# EAGLE design controller (EAGLE 5.07)
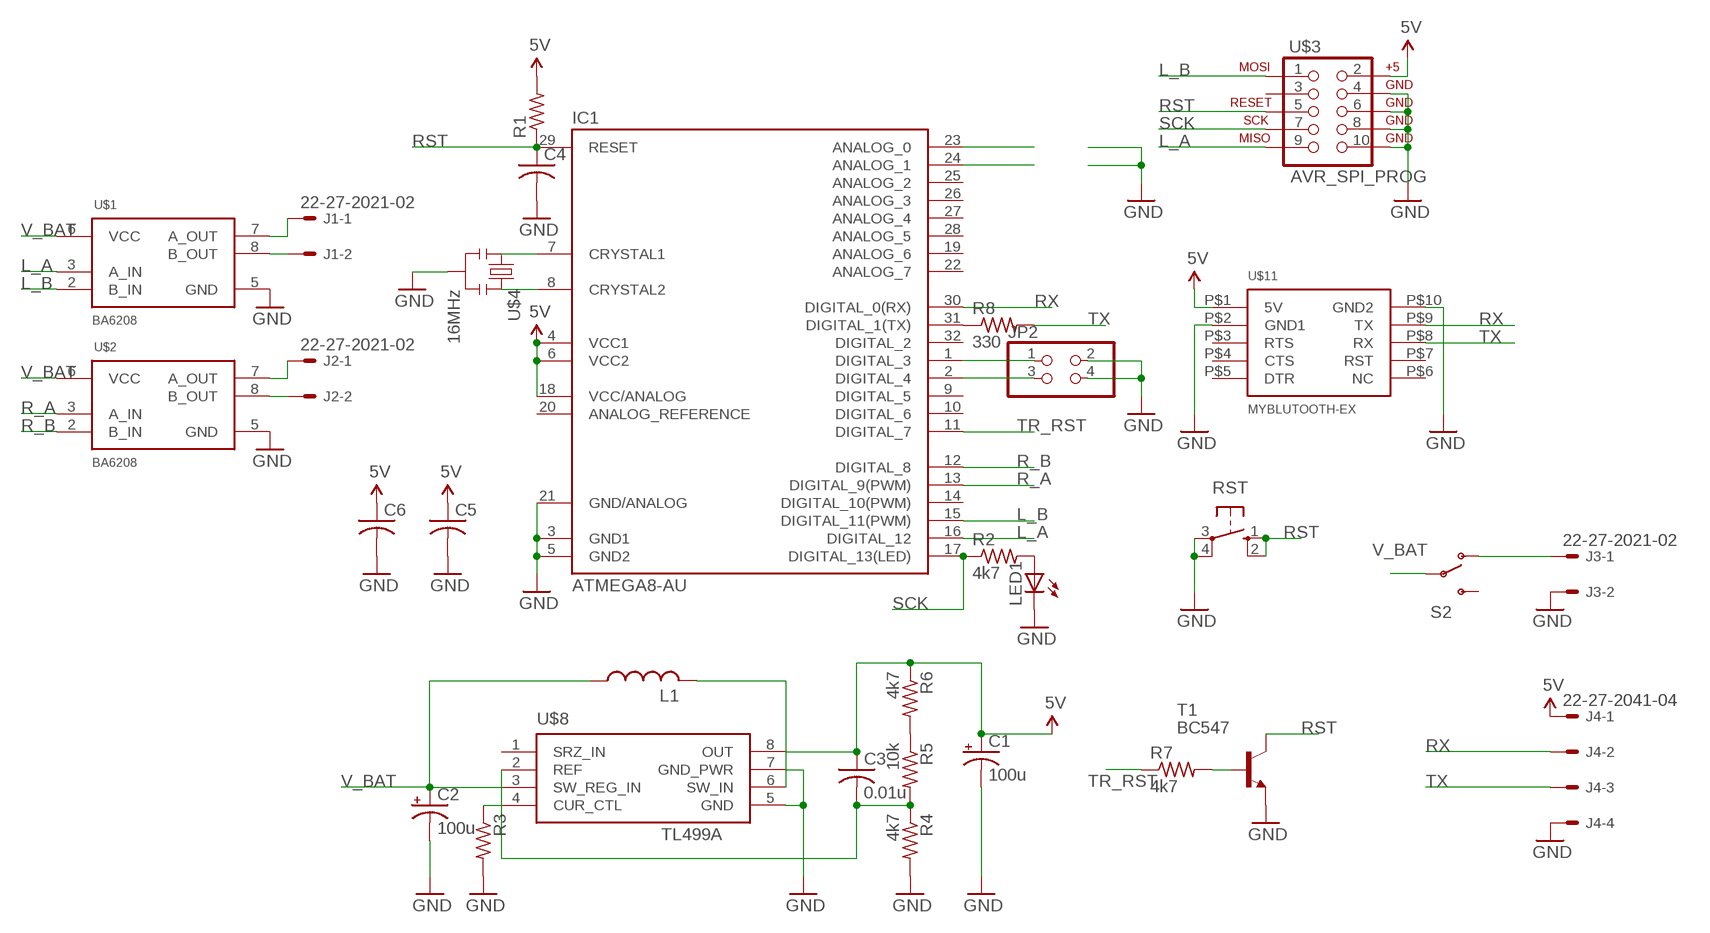
[diagram p0: schematic, sheet 1]

## Parts
C1  100u  CPOL-USE2,5-6E  [E2,5-6E]
C2  100u  CPOL-USE2,5-6E  [E2,5-6E]
C3  0.01u  C-US050-025X075  [C050-025X075]
C4  C-US050-025X075  [C050-025X075]
C5  C-US050-025X075  [C050-025X075]
C6  C-US050-025X075  [C050-025X075]
IC1  ATMEGA8-AU  [TQFP32-08]
J1  22-27-2021-02  [6410-02]
J2  22-27-2021-02  [6410-02]
J3  22-27-2021-02  [6410-02]
J4  22-27-2041-04  [6410-04]
JP2  PINHD-2X2  [2X02]
L1  L-USTJ3-U1  [TJ3-U1]
LED1  LED5MM  [LED5MM]
R1  R-US_0207/10  [0207/10]
R2  4k7  R-US_0207/7  [0207/7]
R3  R-US_0207/7  [0207/7]
R4  4k7  R-US_0207/7  [0207/7]
R5  10k  R-US_0207/7  [0207/7]
R6  4k7  R-US_0207/7  [0207/7]
R7  4k7  R-US_0207/7  [0207/7]
R8  330  R-US_0207/7  [0207/7]
RST  10-XX  [B3F-10XX]
S2  SWITCH-SPSTPTH  [SWITCH-SPDT]
T1  BC547  [TO92]
U$1  BA6208  [SIP-9]
U$2  BA6208  [SIP-9]
U$3  AVR_SPI_PROG  [AVR_ICSP]
U$4  16MHz  RESONATORPTH  [RESONATOR-PTH]
U$8  TL499A  [DIL08]
U$11  MYBLUTOOTH-EX  [WITHROBOT_SERIAL]

## Nets
5V: C1.+ C3.1 C5.1 C6.1 IC1.4(VCC1) IC1.6(VCC2) IC1.18(VCC/ANALOG) J4.1 R1.2 R6.1 U$3.2 U$8.8(OUT) U$11.P$1(5V)
GND: C1.- C2.- C4.2 C5.2 C6.2 IC1.3(GND1) IC1.5(GND2) IC1.21(GND/ANALOG) J3.2 J4.4 JP2.2 JP2.4 LED1.K(C) R3.2 R4.2 RST.3(P) RST.4(P1) T1.1(E) U$1.5(GND) U$2.5(GND) U$3.4 U$3.6 U$3.8 U$3.10 U$4.2 U$8.5(GND) U$8.7(GND_PWR) U$11.P$2(GND1) U$11.P$10(GND2)
L_A: IC1.16(DIGITAL_12) U$1.3(A_IN) U$3.9
L_B: IC1.15(DIGITAL_11(PWM)) U$1.2(B_IN) U$3.1
N$1: IC1.8(CRYSTAL2) U$4.3
N$2: IC1.7(CRYSTAL1) U$4.1
N$3: J2.2 U$2.8(B_OUT)
N$4: J2.1 U$2.7(A_OUT)
N$5: J1.2 U$1.8(B_OUT)
N$6: J1.1 U$1.7(A_OUT)
N$7: LED1.A R2.2
N$8: J3.1 S2.1(O)
N$9: R3.1 U$8.4(CUR_CTL)
N$10: C3.2 R4.1 R5.2 U$8.2(REF)
N$11: IC1.23(ANALOG_0)
N$12: R5.1 R6.2
N$13: L1.2 U$8.6(SW_IN)
N$14: R7.2 T1.2(B)
N$15: IC1.24(ANALOG_1)
N$16: IC1.1(DIGITAL_3) JP2.1
N$17: IC1.2(DIGITAL_4) JP2.3
N$18: IC1.31(DIGITAL_1(TX)) R8.1
R_A: IC1.13(DIGITAL_9(PWM)) U$2.3(A_IN)
R_B: IC1.12(DIGITAL_8) U$2.2(B_IN)
RST: C4.1 IC1.29(RESET) R1.1 RST.1(S) RST.2(S1) T1.3(C) U$3.5
RX: IC1.30(DIGITAL_0(RX)) J4.2 U$11.P$9(TX)
SCK: IC1.17(DIGITAL_13(LED)) R2.1 U$3.7
TR_RST: IC1.11(DIGITAL_7) R7.1
TX: J4.3 R8.2 U$11.P$8(RX)
V_BAT: C2.+ L1.1 S2.2(P) U$1.6(VCC) U$2.6(VCC) U$8.3(SW_REG_IN)
Unconnected: IC1.9(DIGITAL_5) IC1.10(DIGITAL_6) IC1.14(DIGITAL_10(PWM)) IC1.19(ANALOG_6) IC1.20(ANALOG_REFERENCE) IC1.22(ANALOG_7) IC1.25(ANALOG_2) IC1.26(ANALOG_3) IC1.27(ANALOG_4) IC1.28(ANALOG_5) IC1.32(DIGITAL_2) S2.3(S) U$3.3 U$8.1(SRZ_IN) U$11.P$3(RTS) U$11.P$4(CTS) U$11.P$5(DTR) U$11.P$6(NC) U$11.P$7(RST)

## Library data of the parts
C1 C2 = rcl:CPOL-US: POLARIZED CAPACITOR, American symbol
C3-C6 = rcl:C-US: CAPACITOR, American symbol
IC1 = Arduino-AVR:ATMEGA8
J1-J3 = con-molex:22-?-02: CONNECTOR wire to board 2.54 mm (.1 inch) pitch header
J4 = con-molex:22-?-04: CONNECTOR wire to board 2.54 mm (.1 inch) pitch header
JP2 = pinhead:PINHD-2X2: PIN HEADER
L1 = rcl:L-US: INDUCTOR, American symbol
LED1 = led:LED: LED OSRAM: - CHIPLED LG R971, LG N971, LY N971, LG Q971, LY Q971, LO R971, LY R971 LH N974, LH R974 LS Q976, LO Q976, LY Q976 LO Q996 - Hyper CHIPLED LW Q18S LB Q993, LB Q99A, LB R99A - SideLED LS A670, LO A670, LY A670, LG A670, LP A670 LB A673, LV A673, LT A673, LW A673 LH A674 LY A675 LS A676, LA A676, LO A676, LY A676, LW A676 LS A679, LY A679, LG A679 - Hyper Micro SIDELED® LS Y876, LA Y876, LO Y876, LY Y876 LT Y87S - SmartLED LW L88C, LW L88S LB L89C, LB L89S, LG L890 LS L89K, LO L89K, LY L89K LS L896, LA L896, LO L896, LY L896 - TOPLED LS T670, LO T670, LY T670, LG T670, LP T670 LSG T670, LSP T670, LSY T670, LOP T670, LYG T670 LG T671, LOG T671, LSG T671 LB T673, LV T673, LT T673, LW T673 LH T674 LS T676, LA T676, LO T676, LY T676, LB T676, LH T676, LSB T676, LW T676 LB T67C, LV T67C, LT T67C, LS T67K, LO T67K, LY T67K, LW E67C LS E67B, LA E67B, LO E67B, LY E67B, LB E67C, LV E67C, LT E67C LW T67C LS T679, LY T679, LG T679 LS T770, LO T770, LY T770, LG T770, LP T770 LB T773, LV T773, LT T773, LW T773 LH T774 LS E675, LA E675, LY E675, LS T675 LS T776, LA T776, LO T776, LY T776, LB T776 LHGB T686 LT T68C, LB T68C - Hyper Mini TOPLED® LB M676 - Mini TOPLED Santana® LG M470 LS M47K, LO M47K, LY M47K Source: http://www.osram.convergy.de LUXEON: - LUMILED® LXK2-PW12-R00, LXK2-PW12-S00, LXK2-PW14-U00, LXK2-PW14-V00 LXK2-PM12-R00, LXK2-PM12-S00, LXK2-PM14-U00 LXK2-PE12-Q00, LXK2-PE12-R00, LXK2-PE12-S00, LXK2-PE14-T00, LXK2-PE14-U00 LXK2-PB12-K00, LXK2-PB12-L00, LXK2-PB12-M00, LXK2-PB14-N00, LXK2-PB14-P00, LXK2-PB14-Q00 LXK2-PR12-L00, LXK2-PR12-M00, LXK2-PR14-Q00, LXK2-PR14-R00 LXK2-PD12-Q00, LXK2-PD12-R00, LXK2-PD12-S00 LXK2-PH12-R00, LXK2-PH12-S00 LXK2-PL12-P00, LXK2-PL12-Q00, LXK2-PL12-R00 Source: www.luxeon.com KINGBRIGHT: KA-3528ASYC Source: www.kingbright.com
R1-R8 = resistor:R-US_: RESISTOR, American symbol
RST = switch-omron:10-XX: OMRON SWITCH
S2 = SparkFun:SWITCH-SPST: SPST Switch Simple slide switch. Spark Fun Electronics SKU : COM-00102
T1 = transistor:BC547: NPN TRANSISTOR
U$1 U$2 = suapapa:BA6208
U$3 = SparkFun:AVR_SPI_PROG: AVR ICSP Header This is the standard AVR In Circuit Serial Programming header. Minimal, but includes pin one indicator. Works with standard Olimex programmers. Also look for the 6-pin reduced version. Spark Fun Electronics SKU: PRT-00778
U$4 = SparkFun:RESONATOR: Resonator Small SMD resonator. This is the itty bitty 10/20MHz resonators with built in caps. CSTCE10M0G55 and CSTCE20M0V53. Footprint has been reviewed closely but hasn't been tested yet.
U$8 = suapapa:TL499A
U$11 = suapapa:MYBLUTOOTH-EX

## Board
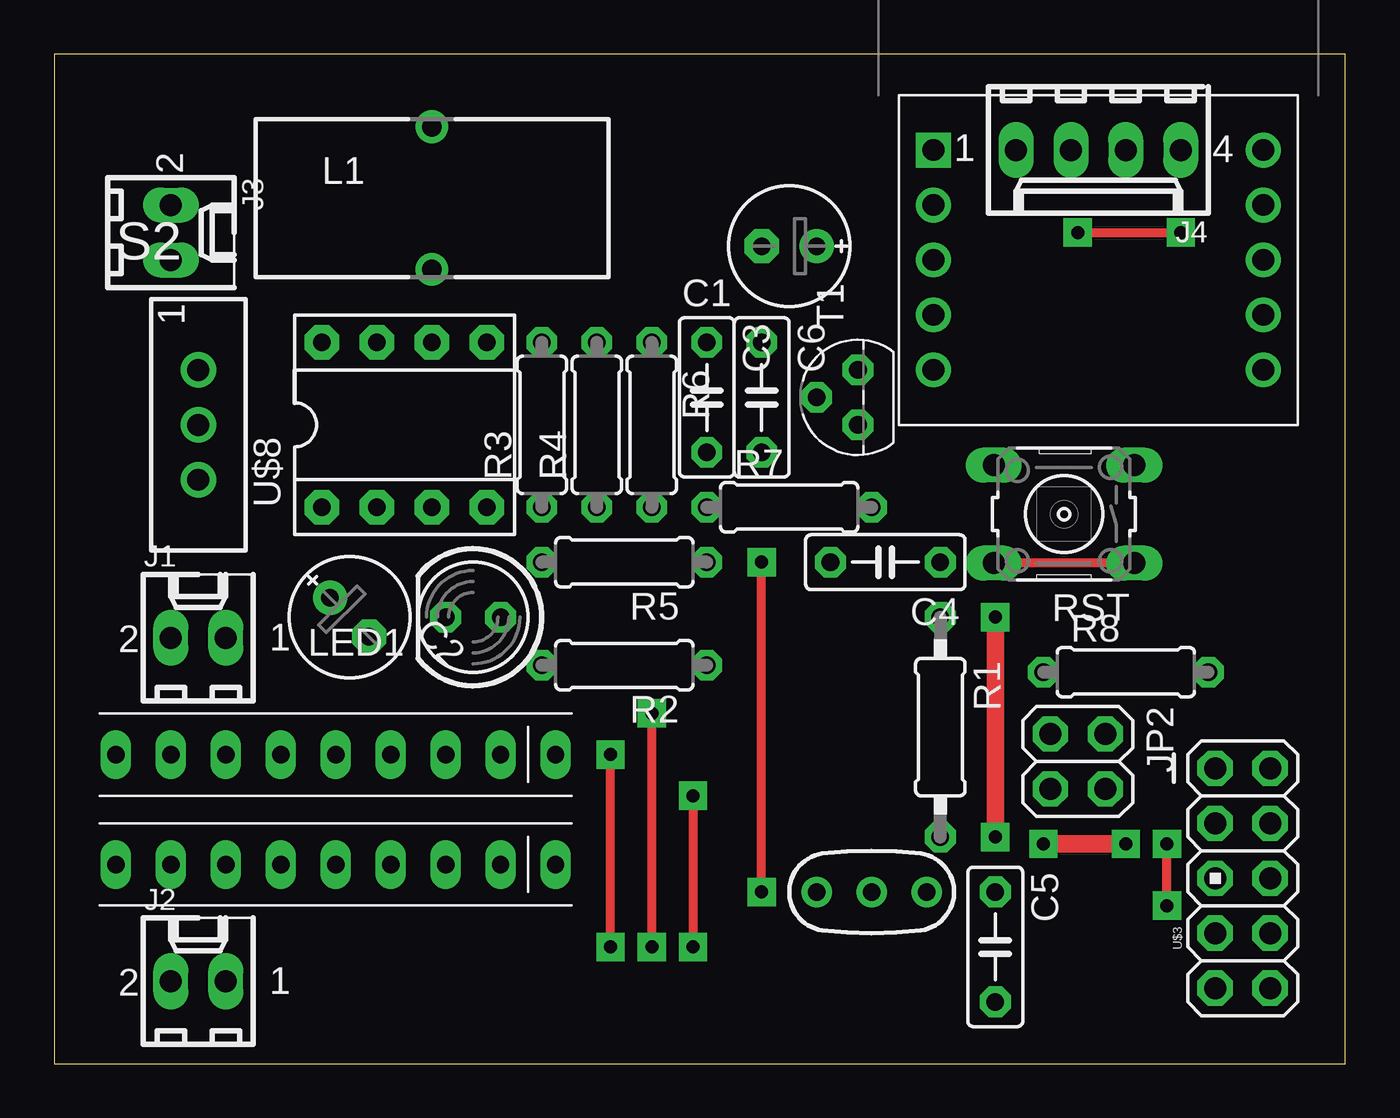
[diagram p1: board, top side]
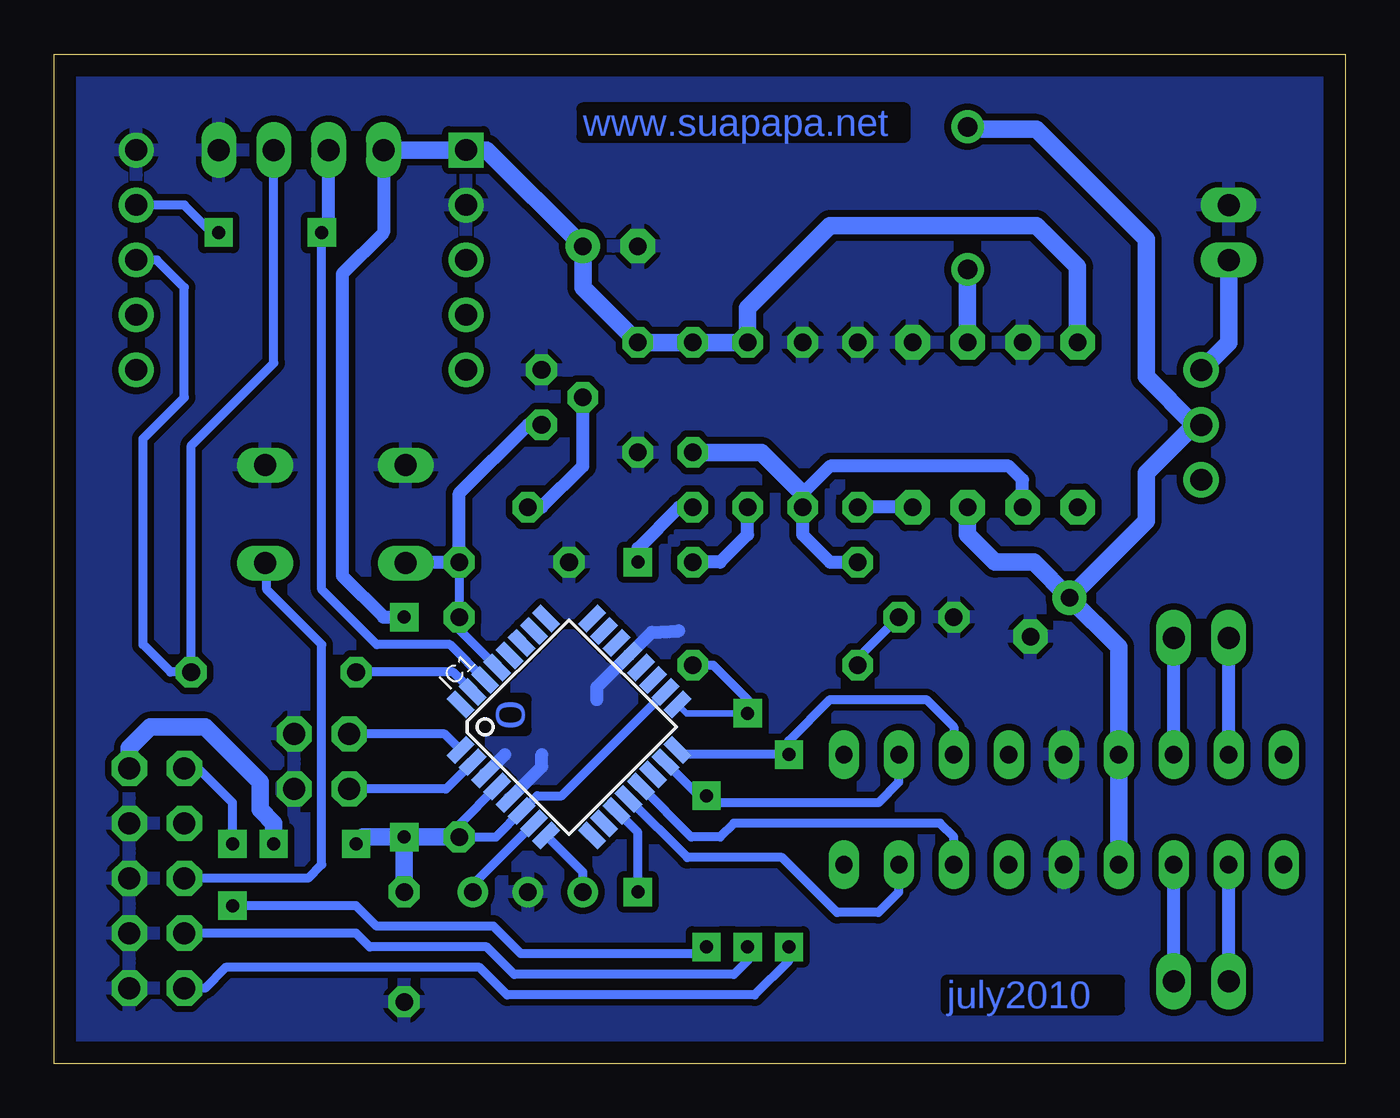
[diagram p2: board, bottom side, seen from below]

Size 59.68 x 46.66 mm. Coordinates in mm from the lower left corner, seen from the top.
Outline: 0,0 59.68,0 59.68,46.66 0,46.66 0,0
Copper layers (1*16): Top 0.035mm / dielectric 1.5mm / Bottom 0.035mm
Design rules "default *": minimum track width 10mil, minimum drill 24mil, track to track 12mil, track to pad 18mil, pad to pad 8mil, via to via 8mil, smd to smd 8mil, copper to edge 40mil, drill to drill 8mil, minimum pad ring 12mil, minimum via ring 14mil, stop-mask expansion 4mil, vias tented up to drill 0mil, thermal gap 10mil

### Footprints (pad centres in the part's own frame; a part is rotated, then mirrored left to right if it is on the bottom)
E2,5-6E = drill 0.813 pad 1.575 round: + -1.27,0 | drill 0.813 pad 1.575 octagon: - 1.27,0
C050-025X075 = drill 0.813 octagon: 1 -2.54,0; 2 2.54,0
TQFP32-08 = smd 1.27 x 0.559: 1 -4.293,2.8; 2 -4.293,2; 3 -4.293,1.2; 4 -4.293,0.4; 5 -4.293,-0.4; 6 -4.293,-1.2; 7 -4.293,-2; 8 -4.293,-2.8; 17 4.293,-2.8; 18 4.293,-2; 19 4.293,-1.2; 20 4.293,-0.4; 21 4.293,0.4; 22 4.293,1.2; 23 4.293,2; 24 4.293,2.8 | smd 0.559 x 1.27: 9 -2.8,-4.293; 10 -2,-4.293; 11 -1.2,-4.293; 12 -0.4,-4.293; 13 0.4,-4.293; 14 1.2,-4.293; 15 2,-4.293; 16 2.8,-4.293; 25 2.8,4.293; 26 2,4.293; 27 1.2,4.293; 28 0.4,4.293; 29 -0.4,4.293; 30 -1.2,4.293; 31 -2,4.293; 32 -2.8,4.293
6410-02 = drill 1.016 long: 1 1.27,0; 2 -1.27,0
6410-04 = drill 1.016 long: 1 3.81,0; 2 1.27,0; 3 -1.27,0; 4 -3.81,0
2X02 = drill 1.016 octagon: 1 -1.27,-1.27; 2 -1.27,1.27; 3 1.27,-1.27; 4 1.27,1.27
TJ3-U1 = drill 0.9 round: 1 -3.3,0; 2 3.3,0
LED5MM = drill 0.813 octagon: A -1.27,0; K 1.27,0
0207/10 = drill 0.813 octagon: 1 -5.08,0; 2 5.08,0
0207/7 = drill 0.813 octagon: 1 -3.81,0; 2 3.81,0
B3F-10XX = drill 1.016 long: 1 -3.251,2.261; 2 3.251,2.261; 3 -3.251,-2.261; 4 3.251,-2.261
SWITCH-SPDT = drill 1.016 round: 1 0,2.54; 2 0,0; 3 0,-2.54
TO92 = drill 0.813 octagon: 1 1.27,0; 2 0,1.905; 3 -1.27,0
SIP-9 = drill 0.8 long: 1 -10.16,0; 2 -7.62,0; 3 -5.08,0; 4 -2.54,0; 5 0,0; 6 2.54,0; 7 5.08,0; 8 7.62,0; 9 10.16,0
AVR_ICSP = drill 1.016 octagon: 1 -1.27,5.08; 2 1.27,5.08; 3 -1.27,2.54; 4 1.27,2.54; 5 -1.27,0; 6 1.27,0; 7 -1.27,-2.54; 8 1.27,-2.54; 9 -1.27,-5.08; 10 1.27,-5.08
RESONATOR-PTH = drill 0.8 round: 1 -2.54,0; 2 0,0; 3 2.54,0
DIL08 = drill 0.813 pad 1.6 octagon: 1 -3.81,-3.81; 2 -1.27,-3.81; 3 1.27,-3.81; 4 3.81,-3.81; 5 3.81,3.81; 6 1.27,3.81; 7 -1.27,3.81; 8 -3.81,3.81
WITHROBOT_SERIAL = drill 1 square: P$1 -7.62,5.08 | drill 1 round: P$2 -7.62,2.54; P$3 -7.62,0; P$4 -7.62,-2.54; P$5 -7.62,-5.08; P$6 7.62,-5.08; P$7 7.62,-2.54; P$8 7.62,0; P$9 7.62,2.54; P$10 7.62,5.08

### Placement (x,y rotation side)
C1  33.97,37.78 180 top
C2  13.65,20.64 315 top
C3  30.16,30.8 270 top
C4  38.42,23.18 180 top
C5  43.5,5.4 270 top
C6  32.7,30.8 270 top
IC1  35.88,15.56 45 bottom
J1  6.67,19.69 0 top
J2  6.67,3.81 0 top
J3  5.4,38.42 270 top
J4  48.26,42.23 180 top
JP2  47.31,13.97 270 top
L1  17.46,40 270 top
LED1  19.37,20.64 180 top
R1  40.96,15.56 270 top
R2  26.35,18.42 180 top
R3  22.54,29.53 90 top
R4  25.08,29.53 90 top
R5  26.35,23.18 180 top
R6  27.62,29.53 270 top
R7  33.97,25.72 0 top
R8  49.53,18.1 0 top
RST  46.67,25.4 180 top
S2  6.67,29.53 0 top
T1  37.15,30.8 90 top
U$1  13.02,14.29 180 top
U$2  13.02,9.21 180 top
U$3  54.93,8.57 0 top
U$4  37.78,7.94 180 top
U$8  16.19,29.53 0 top
U$11  48.26,37.15 0 top

### Tracks (layer width: path | path; a pad name or v marks a point on that pad's centre or on a via)
5V  (via drill 0.6)
  Top 0.813: v43.5,20.64 v43.5,10.48 | v45.72,10.16 v49.53,10.16
  Bottom 0.406: IC1.18 36.22,12.38 37.36,12.38 IC1.6 39.26,10.48 R1.2 40.96,11.04 IC1.4
  Bottom 0.61: v43.5,20.64 44.45,20.64 46.35,22.54 46.35,36.51 44.45,38.42 J4.1
  Bottom 0.813: J4.1 U$11.P$1 39.69,42.23 C1.+ 35.24,35.88 C6.1 C3.1 R6.1 27.62,34.92 23.81,38.74 14.29,38.74 12.38,36.83 U$8.8 | v43.5,10.48 R1.2 | v43.5,10.48 C5.1 | v43.5,10.48 45.4,10.48 v45.72,10.16 | U$3.2 56.2,14.6 55.24,15.56 52.71,15.56 50.17,13.02 50.17,11.75 49.53,11.11 v49.53,10.16
GND
  Bottom 0.61: IC1.5 37.15,13.72 37.15,14.29 | IC1.3 38.84,14.29 | 34.61,16.83 34.61,17.39 IC1.21 32.07,19.93 30.8,20
  pour Bottom: -0.64,47.31 59.37,47.31 59.37,-0.64 -0.64,-0.64
L_A  (via drill 0.6)
  Top 0.406: v25.72,5.4 v25.72,14.29
  Bottom 0.406: U$1.3 18.1,15.56 19.37,16.83 23.81,16.83 25.72,14.92 v25.72,14.29 30.65,14.29 arc90 IC1.16 | v25.72,5.4 25.72,4.76 27.3,3.18 38.74,3.18 40,4.45 51.75,4.45 52.71,3.49 U$3.9
L_B  (via drill 0.6)
  Top 0.406: v29.53,12.38 v29.53,5.4 | v51.43,7.3 v51.43,10.16
  Bottom 0.406: U$1.2 20.64,13.02 21.59,12.07 29.21,12.07 v29.53,12.38 29.87,12.38 IC1.15 | v29.53,5.4 29.85,5.08 38.1,5.08 39.37,6.35 44.77,6.35 45.72,7.3 v51.43,7.3 | v51.43,10.16 51.43,12.07 53.02,13.65 U$3.1
N$1
  Bottom 0.406: IC1.8 35.24,8.85 U$4.3
N$2
  Bottom 0.406: IC1.7 40.32,8.28 U$4.1
N$3
  Bottom 0.61: J2.2 U$2.8
N$4
  Bottom 0.61: J2.1 U$2.7
N$5
  Bottom 0.61: U$1.8 J1.2
N$6
  Bottom 0.61: U$1.7 J1.1
N$7
  Bottom 0.406: R2.2 22.54,18.73 LED1.A
N$8
  Bottom 0.813: J3.1 5.4,33.34 S2.1
N$9
  Bottom 0.61: U$8.4 R3.1
N$10
  Bottom 0.61: U$8.2 14.92,26.99 15.56,27.62 23.81,27.62 25.08,26.35 R4.1 25.08,24.45 23.81,23.18 R5.2
  Bottom 0.813: C3.2 26.99,28.26 25.08,26.35
N$12
  Bottom 0.61: R6.2 27.62,24.45 28.89,23.18 R5.1
N$13
  Bottom 0.813: U$8.6 L1.2
N$14
  Bottom 0.61: T1.2 35.24,27.62 37.15,25.72 R7.2
N$16
  Bottom 0.406: IC1.1 41.63,15.24 JP2.1
N$17
  Bottom 0.406: IC1.2 41.56,12.7 JP2.3
N$18
  Bottom 0.406: IC1.31 41.25,18.1 R8.1
R_A
  Bottom 0.406: IC1.13 30.23,10.48 28.89,10.48 28.26,11.11 18.73,11.11 18.1,10.48 U$2.3
R_B
  Bottom 0.406: IC1.12 30.41,9.52 26.03,9.52 23.49,6.99 21.59,6.99 20.64,7.94 U$2.2
RST
  Top 0.406: RST.1 RST.2
  Bottom 0.406: IC1.29 40.96,20.07 R1.1 C4.1 | RST.1 49.85,23.06 49.85,21.91 47.31,19.37 47.31,9.21 47.94,8.57 U$3.5
  Bottom 0.61: RST.2 43.38,23.18 C4.1 40.96,26.35 37.78,29.53 T1.3
RX  (via drill 0.6)
  Top 0.406: v47.31,38.42 v52.07,38.42
  Bottom 0.406: IC1.30 41.38,19.37 44.77,19.37 47.31,21.91 v47.31,38.42 | v52.07,38.42 52.39,38.42 53.66,39.69 U$11.P$9
  Bottom 0.61: J4.2 46.99,38.74 v47.31,38.42
SCK  (via drill 0.6)
  Top 0.406: v27.62,5.4 v27.62,16.19
  Bottom 0.305: IC1.17 30.44,16.19 v27.62,16.19
  Bottom 0.406: v27.62,5.4 27.62,4.76 28.26,4.13 38.42,4.13 39.69,5.4 45.09,5.4 45.72,6.03 U$3.7 | v27.62,16.19 27.62,16.83 29.21,18.42 R2.1
TR_RST  (via drill 0.6)
  Top 0.406: v32.7,7.94 v32.7,23.18
  Bottom 0.406: v32.7,7.94 32.7,10.69 IC1.11
  Bottom 0.61: v32.7,23.18 32.7,23.81 30.8,25.72 R7.1
TX
  Bottom 0.406: J4.3 49.53,32.39 53.34,28.57 R8.2 54.29,18.1 55.56,19.37 55.56,28.89 53.66,30.8 53.66,35.88 54.93,37.15 U$11.P$8
V_BAT
  Bottom 0.813: U$2.6 U$1.6 10.48,19.26 C2.+ | U$8.3 17.46,24.45 16.19,23.18 14.4,23.18 C2.+ | 6.99,29.53 S2.2 | 6.99,29.53 9.21,27.3 9.21,25.08 C2.+ | 6.99,29.53 9.21,31.75 9.21,38.1 14.29,43.18 17.34,43.18 L1.1

### Text on the board
Bottom: www.suapapa.net | o | july2010